# Altium schematic sheet motherboard_power.SchDoc
size 420 x 297 mm; SheetNumber: 5; SheetTotal: 5
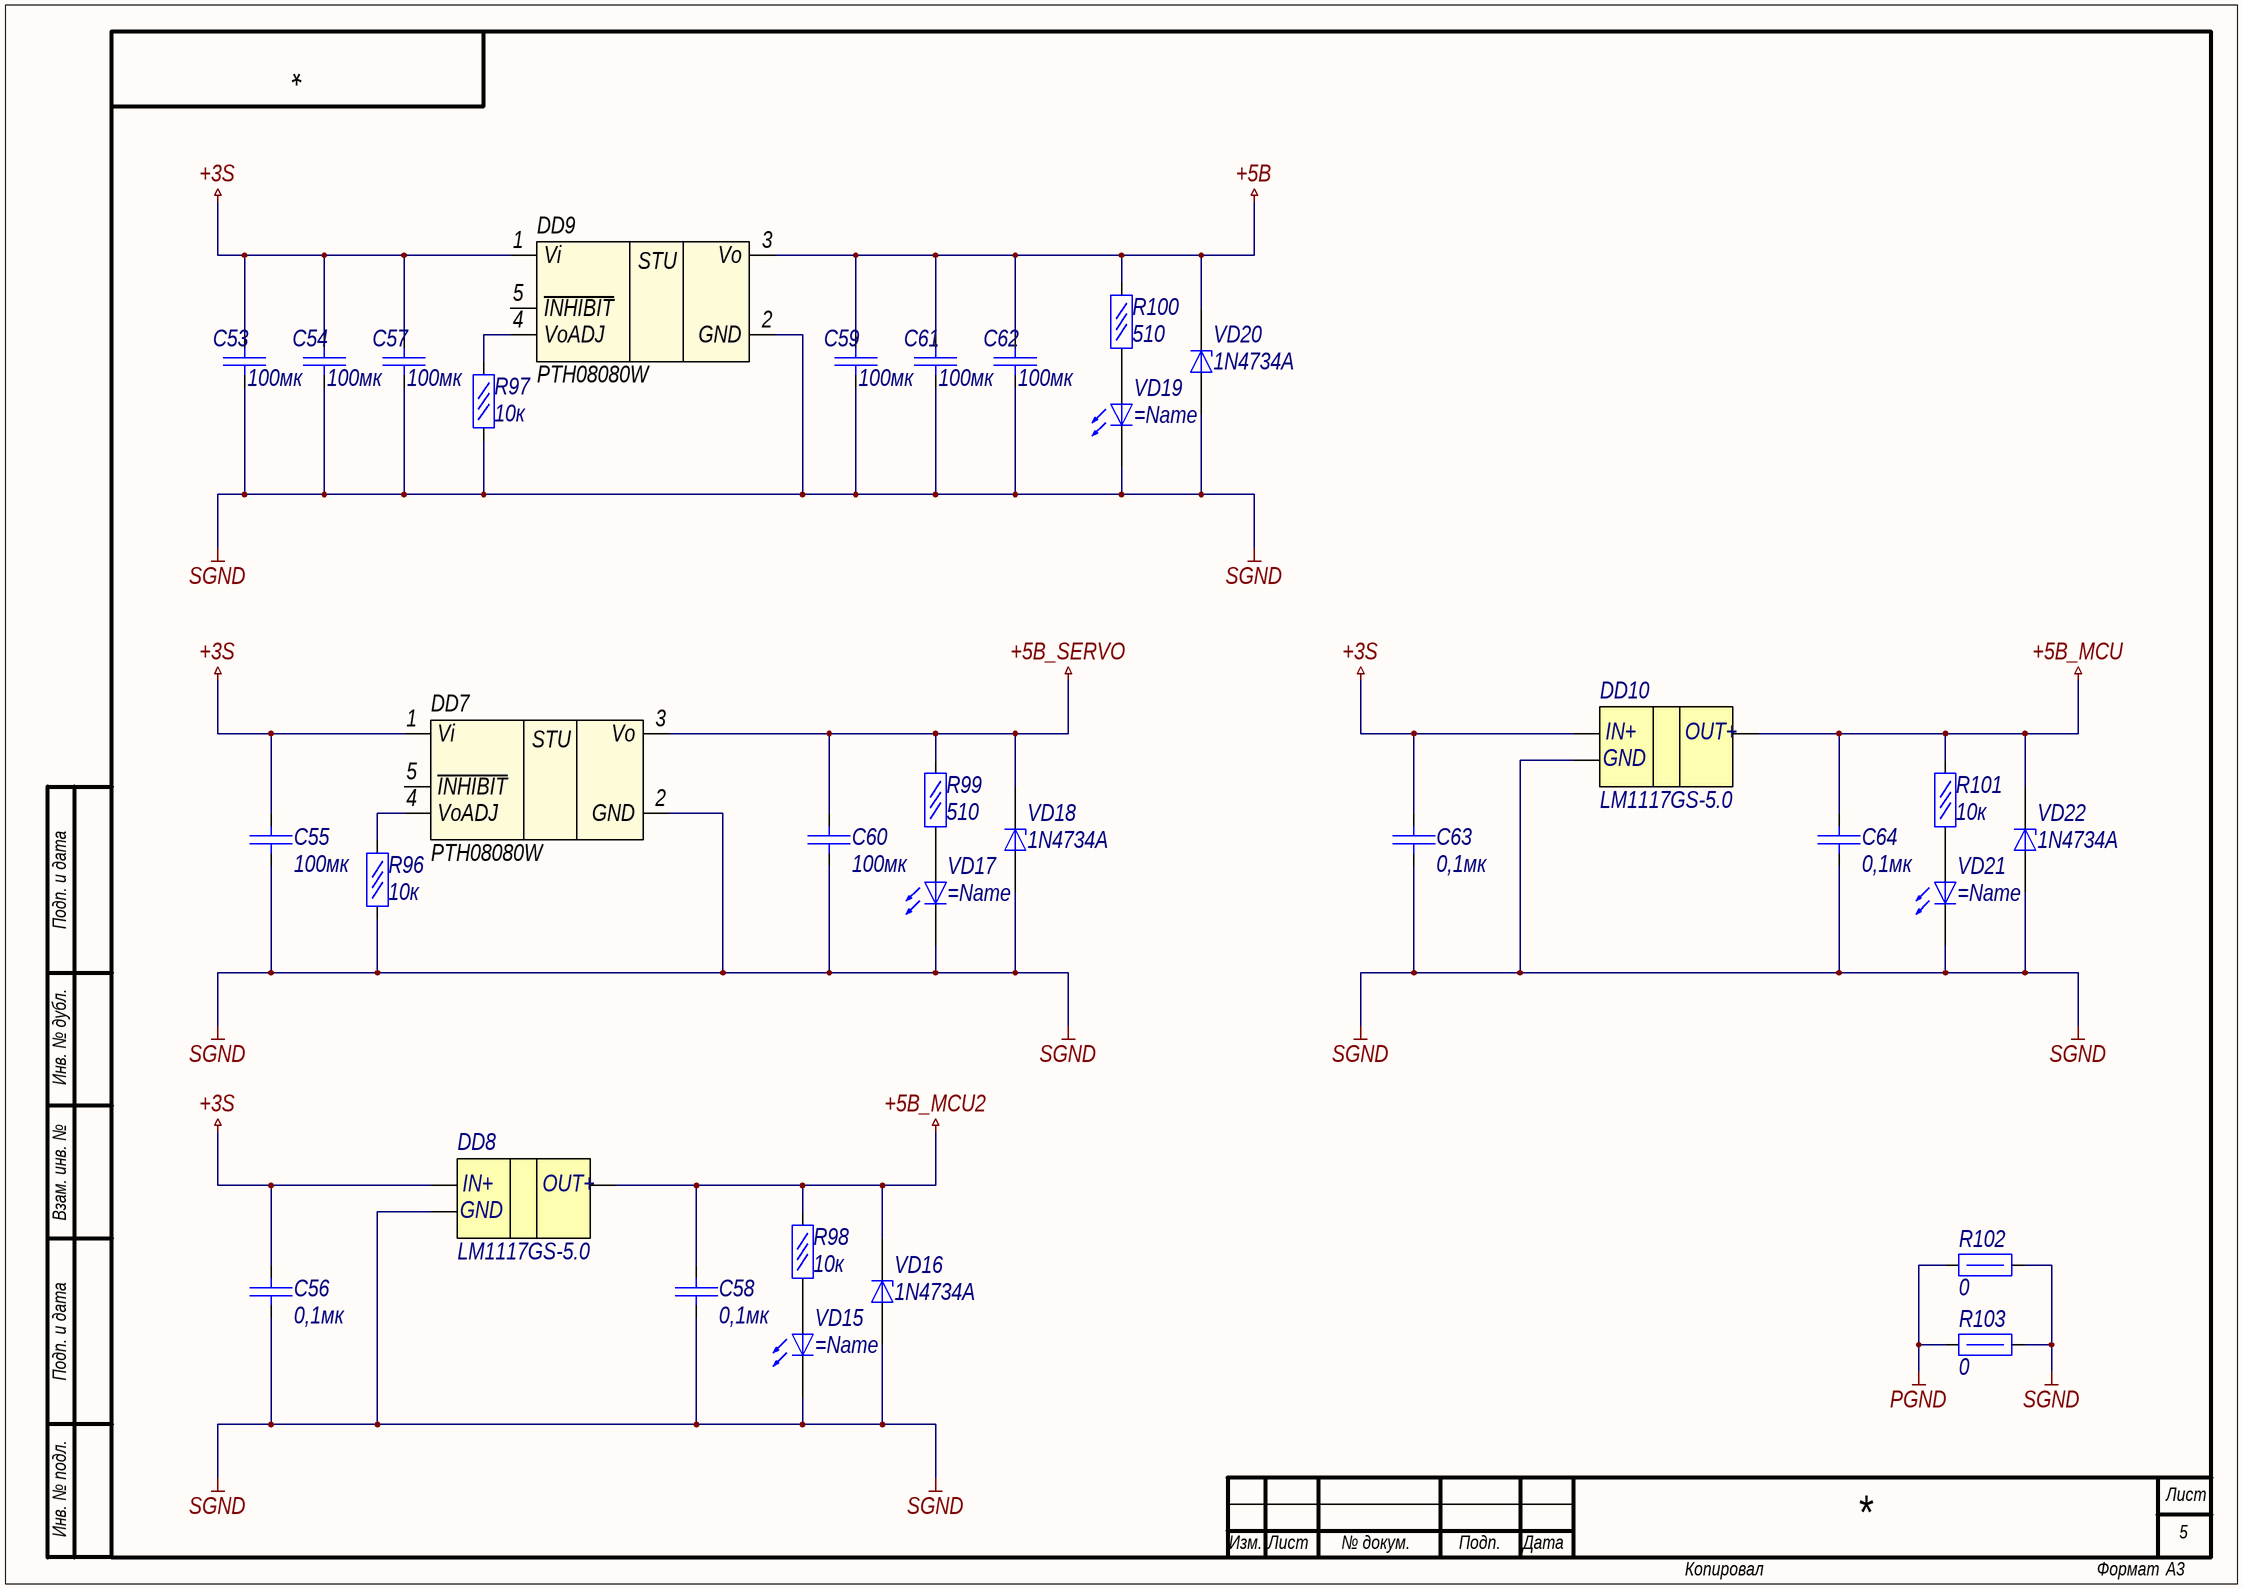
[diagram p0: motherboard_power.SchDoc]

## Parts
DD7  PTH08080W  [PTH08080W]
DD8  LM1117GS-5.0  [SOT-223]
DD9  PTH08080W  [PTH08080W]
DD10  LM1117GS-5.0  [SOT-223]
R96  10к  [R0603]
R97  10к  [R0603]
R98  10к  [R0603]
R99  510  [R0603]
R100  510  [R0603]
R101  10к  [R0603]
R102  0  [R1210]
R103  0  [R1210]
VD15  (no value)  [0603 - led]
VD16  1N4734A  [DO-41 Vertical]
VD17  (no value)  [0603 - led]
VD18  1N4734A  [DO-41 Vertical]
VD19  (no value)  [0603 - led]
VD20  1N4734A  [DO-41 Vertical]
VD21  (no value)  [0603 - led]
VD22  1N4734A  [DO-41 Vertical]
С53  100мк  [C1210_AA - 2.5]
С54  100мк  [C1210_AA - 2.5]
С55  100мк  [C1210_AA - 2.5]
С56  0,1мк  [C0603]
С57  100мк  [C1210_AA - 2.5]
С58  0,1мк  [C0603]
С59  100мк  [C1210_AA - 2.5]
С60  100мк  [C1210_AA - 2.5]
С61  100мк  [C1210_AA - 2.5]
С62  100мк  [C1210_AA - 2.5]
С63  0,1мк  [C0603]
С64  0,1мк  [C0603]

## Nets
+3S: DD7.1(Vi) DD8.3 DD9.1(Vi) DD10.3 С53.2 С54.2 С55.2 С56.2 С57.2 С63.2
+5В: DD9.3(Vo) R100.2 VD20.2(K) С59.2 С61.2 С62.2
+5В_MCU: DD10.2 R101.2 VD22.2(K) С64.2
+5В_MCU2: DD8.2 R98.2 VD16.2(K) С58.2
+5В_SERVO: DD7.3(Vo) R99.2 VD18.2(K) С60.2
PGND: R102.1 R103.1
SGND: DD7.2(GND) DD8.1 DD9.2(GND) DD10.1 R96.1 R97.1 R102.2 R103.2 VD15.2(K) VD16.1(A) VD17.2(K) VD18.1(A) VD19.2(K) VD20.1(A) VD21.2(K) VD22.1(A) С53.1 С54.1 С55.1 С56.1 С57.1 С58.1 С59.1 С60.1 С61.1 С62.1 С63.1 С64.1
NetDD7_4: DD7.4(VoADJ) R96.2
NetDD9_4: DD9.4(VoADJ) R97.2
NetR98_1: R98.1 VD15.1(A)
NetR99_1: R99.1 VD17.1(A)
NetR100_1: R100.1 VD19.1(A)
NetR101_1: R101.1 VD21.1(A)

Not connected (* = marked no-connect by the designer): DD7 5(~{INHIBIT}); DD9 5(~{INHIBIT})

## Notes on the sheet
- Подп. и дата
- Инв. № дубл.
- Взам. инв. №
- Инв. № подл.
- Лист
- Изм.
- № докум.
- Подп.
- Дата
- Копировал
- Формат
- А3
- (in symbol PTH08080W) STU

## Library data of the parts
DD7 DD9 = PTH08080W: DC/DC, 2.5А; Name: PTH08080W
DD8 DD10 = LM1117: Contact_1: IN+; Contact_2: GND; Contact_3: OUT+; Name: LM1117GS-5.0
R96-R101 = Резистор 0.05Вт: Резистор 0,05Вт
  R96-R98 R101: Value: 10к
  R99 R100: Value: 510
R102 R103 = резистор 0.5Вт: Value: 0
VD15 VD17 VD19 VD21 = smd_led: smd led
VD16 VD18 VD20 VD22 = стабилитрон: Case: DO-41; Name: 1N4734A
С53-С64 = Кер. конденсатор
  С53-С55 С57 С59-С62: Value: 100мк
  С56 С58 С63 С64: Value: 0,1мк